# Altium schematic sheet Cap 10uF 1206.schdoc
size 127 x 101 mm
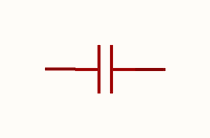
[diagram p0: Cap 10uF 1206.schdoc]

## Parts
C?  10uF  [C1206]  (value not drawn)

## Nets

Not connected (* = marked no-connect by the designer): C? 1 2

## Library data of the parts
C? = GMK316BJ106KL-T: Manufacturer: TAIYO YUDEN(太诱); Add into BOM: yes; Tolerance: ±10%; Symbol: GMK316BJ106KL-T; Device: GMK316BJ106KL-T; LCSC Part Name: 10uF ±10% 35V; Supplier Part: C92797; Manufacturer Part: GMK316BJ106KL-T; Supplier Footprint: 1206; JLCPCB Part Class: Extended Part; Datasheet: https://atta.szlcsc.com/upload/public/pdf/source/20190523/C386043_FECBD8D3F61EFC9AC168A5F10A8CCBD4.pdf; Supplier: LCSC; Convert to PCB: yes; Value: 10uF